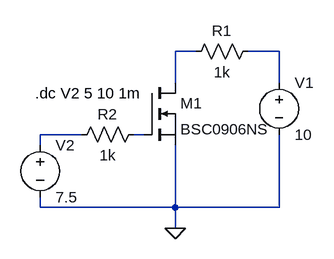
[diagram p0: schematic mosfet2.asc]
mosfet2.asc, the LTspice schematic file:
Version 4.1
SHEET 1 880 680
WIRE 256 128 224 128
WIRE 384 128 336 128
WIRE 224 176 224 128
WIRE 384 176 384 128
WIRE 80 256 16 256
WIRE 176 256 160 256
WIRE 16 272 16 256
WIRE 16 368 16 352
WIRE 224 368 224 272
WIRE 224 368 16 368
WIRE 384 368 384 256
WIRE 384 368 224 368
WIRE 224 400 224 368
FLAG 224 400 0
SYMBOL nmos 176 176 R0
SYMATTR InstName M1
SYMATTR Value BSC0906NS
SYMBOL res 352 112 R90
WINDOW 0 0 56 VBottom 2
WINDOW 3 32 56 VTop 2
SYMATTR InstName R1
SYMATTR Value 1k
SYMBOL voltage 384 160 R0
WINDOW 123 0 0 Left 0
WINDOW 39 0 0 Left 0
SYMATTR InstName V1
SYMATTR Value 10
SYMBOL res 176 240 R90
WINDOW 0 0 56 VBottom 2
WINDOW 3 32 56 VTop 2
SYMATTR InstName R2
SYMATTR Value 1k
SYMBOL voltage 16 256 R0
WINDOW 123 0 0 Left 0
WINDOW 39 0 0 Left 0
SYMATTR InstName V2
SYMATTR Value 7.5
TEXT 8 192 Left 2 !.dc V2 5 10 1m

The netlist it stands for:
* mosfet2.asc
M1 N001 N004 0 0 BSC0906NS
R1 N002 N001 1k
V1 N002 0 10
R2 N004 N003 1k
V2 N003 0 7.5
.model NMOS NMOS
.model PMOS PMOS
.lib standard.mos
.dc V2 5 10 1m
.backanno
.end